# Altium project PCB_项目.PrjPCB
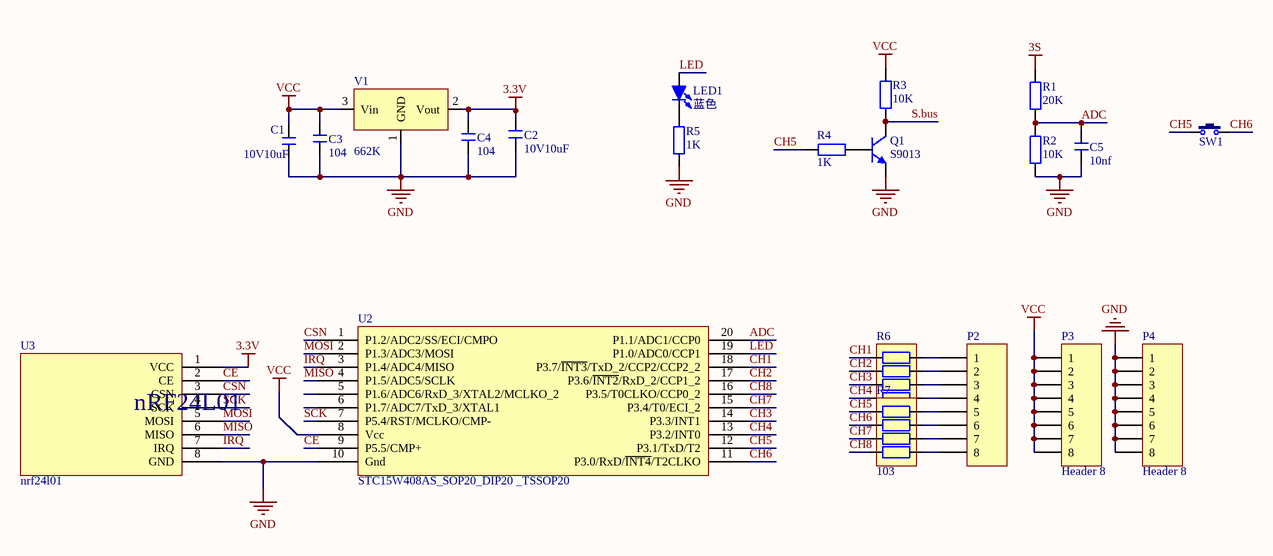
[diagram p0: 原理图.SchDoc]
1 sheet, 21 parts. Net scope: global (net labels, ports and power ports of the same name join across sheets).
Board files: a10.5固件8通接收机sbus.PcbDoc, 拼板.PcbDoc

## Sheet 原理图.SchDoc
size A4

### Parts
C1  10V10uF  [C 0805_L]
C2  10V10uF  [C 0805_L]
C3  104  [C 0603_L]
C4  104  [C 0603_L]
C5  10nf  [C 0603_L]
LED1  蓝色  [LED 0603B]
P2  Header 8  [HDR2.54-LI-8P]  (value not drawn)
P3  Header 8  [HDR2.54-LI-8P]
P4  Header 8  [HDR2.54-LI-8P]
Q1  S9013  [SOT23-3N]
R1  20K  [R 0603_L]
R2  10K  [R 0603_L]
R3  10K  [R 0603_L]
R4  1K  [R 0603_L]
R5  1K  [R 0603_L]
R6  103  [RCA-8P4R-0603]
R7  103  [RCA-8P4R-0603]
SW1  3x6x5  [SW_1]  (value not drawn)
U2  STC15W408AS_SOP20_DIP20 _TSSOP20  [TSSOP20_N]
U3  nrf24l01  [NRF24L01_4to1]
V1  662K  [SOT23-3L]

### Nets
3.3V: C2.2 C4.2 U3.1(VCC) V1.2(Vout)
3S: R1.1
GND: C1.1 C2.1 C3.1 C4.1 C5.2 P4.1 P4.2 P4.3 P4.4 P4.5 P4.6 P4.7 P4.8 Q1.2(E) R2.1 R5.1 U2.10(Gnd) U3.8(GND) V1.1(GND)
VCC: C1.2 C3.2 P3.1 P3.2 P3.3 P3.4 P3.5 P3.6 P3.7 P3.8 R3.2 U2.8(Vcc) V1.3(Vin)
ADC: C5.1 R1.2 R2.2 U2.20(P1.1/ADC1/CCP0)
CE: U2.9(P5.5/CMP+) U3.2(CE)
CH1: R6.1 U2.18(P3.7/~{INT3}/TxD_2/CCP2/CCP2_2)
CH2: R6.2 U2.17(P3.6/~{INT2}/RxD_2/CCP1_2)
CH3: R6.3 U2.14(P3.3/INT1)
CH4: R6.4 U2.13(P3.2/INT0)
CH5: R4.1 R7.1 SW1.1 U2.12(P3.1/TxD/T2)
CH6: R7.2 SW1.2 U2.11(P3.0/RxD/~{INT4}/T2CLKO)
CH7: R7.3 U2.15(P3.4/T0/ECI_2)
CH8: R7.4 U2.16(P3.5/T0CLKO/CCP0_2)
CSN: U2.1(P1.2/ADC2/SS/ECI/CMPO) U3.3(CSN)
IRQ: U2.3(P1.4/ADC4/MISO) U3.7(IRQ)
LED: LED1.1(A) U2.19(P1.0/ADC0/CCP1)
MISO: U2.4(P1.5/ADC5/SCLK) U3.6(MISO)
MOSI: U2.2(P1.3/ADC3/MOSI) U3.5(MOSI)
S.bus: Q1.3(C) R3.1
SCK: U2.7(P5.4/RST/MCLKO/CMP-) U3.4(SCK)
NetLED1_2: LED1.2(K) R5.2
NetP2_1: P2.1 R6.8
NetP2_2: P2.2 R6.7
NetP2_3: P2.3 R6.6
NetP2_4: P2.4 R6.5
NetP2_5: P2.5 R7.8
NetP2_6: P2.6 R7.7
NetP2_7: P2.7 R7.6
NetP2_8: P2.8 R7.5
NetQ1_1: Q1.1(B) R4.2

Not connected (* = marked no-connect by the designer): U2 5(P1.6/ADC6/RxD_3/XTAL2/MCLKO_2) 6(P1.7/ADC7/TxD_3/XTAL1)

### Notes on the sheet
- (in symbol nrf24l01) nRF24L01

### Library data of the parts
C1-C5 = C: 无极性贴片电容; 版权归属: 源创客; BOM名称: 无极性贴片电容; 学习资源: www.ooocke.com
LED1 = LED-SMD: 贴片LED; 版权归属: 源创客; BOM名称: 贴片LED; 学习资源: www.ooocke.com
P2-P4 = Header 8: Header, 8-Pin; LatestRevisionDate: 17-Jul-2002; LatestRevisionNote: Re-released for DXP Platform.; Publisher: Altium Limited
Q1 = 9013-SMD: 低频放大-NPN型; 版权归属: 源创客; 属性: 50V?0.5A?0.625W; BOM名称: 低频放大-NPN型; 学习资源: www.ooocke.com
R1-R5 = R: 贴片电阻; 版权归属: 源创客; BOM名称: 贴片电阻; 学习资源: www.ooocke.com
R6 R7 = R-8P4R: 贴片网络排阻; 版权归属: 源创客; BOM名称: 贴片网络排阻; 学习资源: www.ooocke.com
SW1 = TSW 3x6: 3x6轻触开关; 版权归属: 源创客; BOM名称: 3x6轻触开关; 学习资源: www.ooocke.com
U2 = STC15W401AS_SOP20_DIP20 _TSSOP20